# EAGLE design esp-temperature (EAGLE 8.3.1)
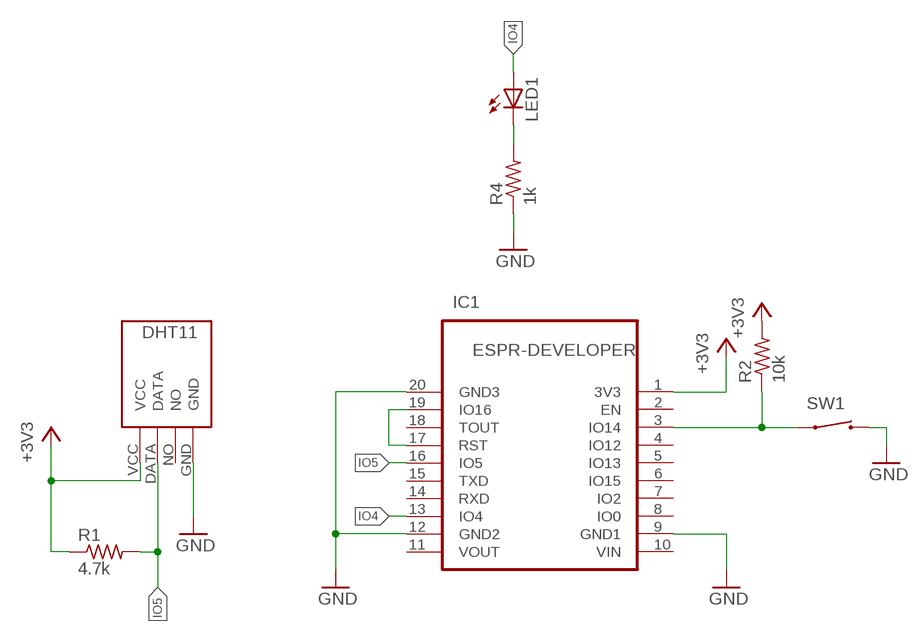
[diagram p0: schematic, sheet 1]

## Parts
IC1  ESPR-DEVELOPER  [ESPR-DEVELOPER]
LED1  LED-SIDEUP2  [LED5MM-SIDE-UP2]
R1  4.7k  R-US_R0805  [R0805]
R2  10k  R-US_R0805  [R0805]
R4  1k  R-US_R0805  [R0805]
SW1  TVBP06  [TVBP06]
U$1  DHT11  [DHT11]

## Nets
+3V3: IC1.1(3V3) R1.1 R2.2 U$1.VCC
GND: IC1.9(GND1) IC1.12(GND2) IC1.20(GND3) R4.1 SW1.2 U$1.GND
IO4: IC1.13(IO4) LED1.A
IO5: IC1.16(IO5) R1.2 U$1.DATA
N$1: IC1.3(IO14) R2.1 SW1.1
N$2: LED1.K(C) R4.2
N$3: IC1.17(RST) IC1.19(IO16)
Unconnected: IC1.2(EN) IC1.4(IO12) IC1.5(IO13) IC1.6(IO15) IC1.7(IO2) IC1.8(IO0) IC1.14(RXD) IC1.15(TXD) IC1.18(TOUT) U$1.NO

## Power pins joined to a net without a drawn wire
VIN: IC1.10(VIN)
VOUT: IC1.11(VOUT)

## Library data of the parts
IC1 = espr-developer:ESPR-DEVELOPER: WiFi module - ESP-WROOM-02
LED1 = led-side:LED-SIDE
R1 R2 R4 = rcl:R-US_: RESISTOR, American symbol
SW1 = switches:TVBP06: 2pin switch. http://akizukidenshi.com/catalog/g/gP-08074/
U$1 = DHT11:DHT11: DHT11 Czujnik temperatury i wilgotności

## Board
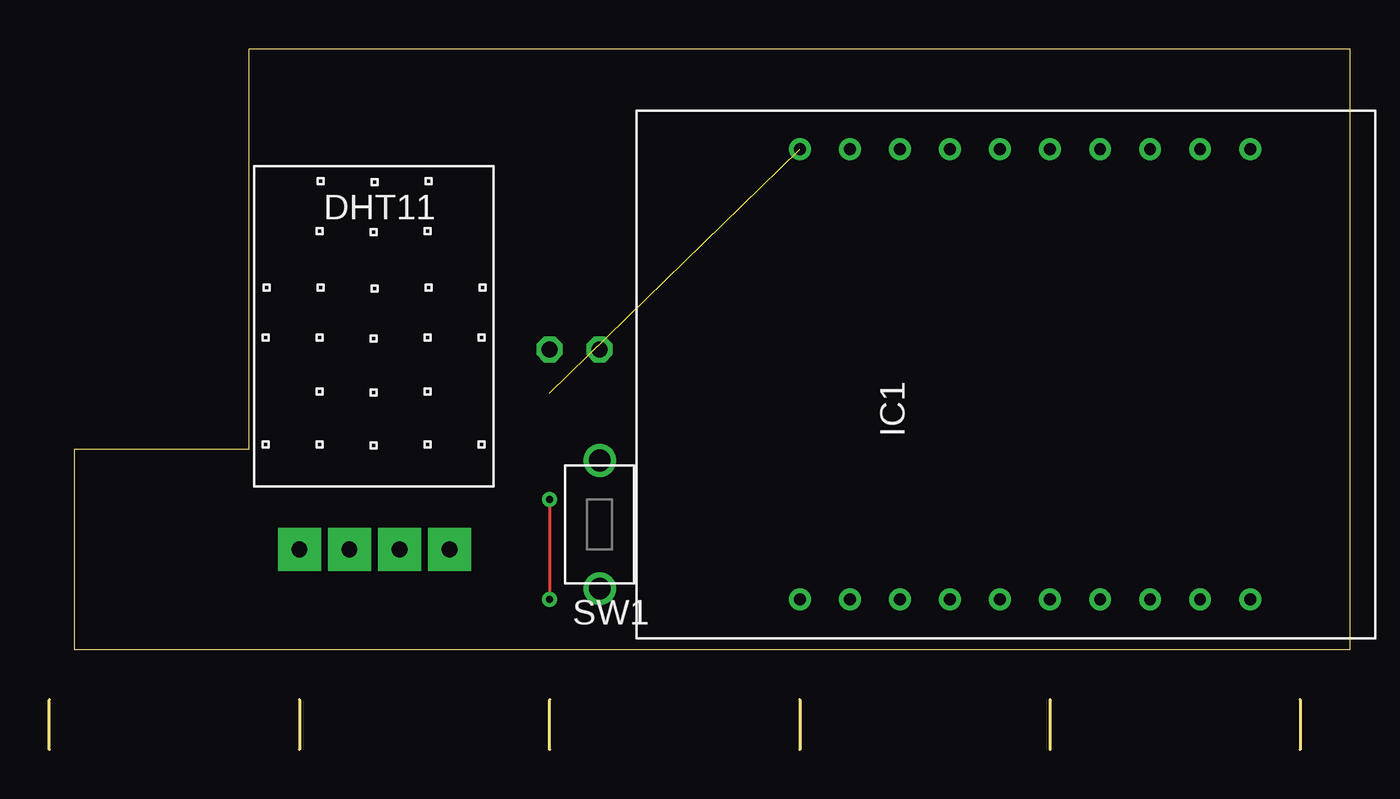
[diagram p1: board, top side]
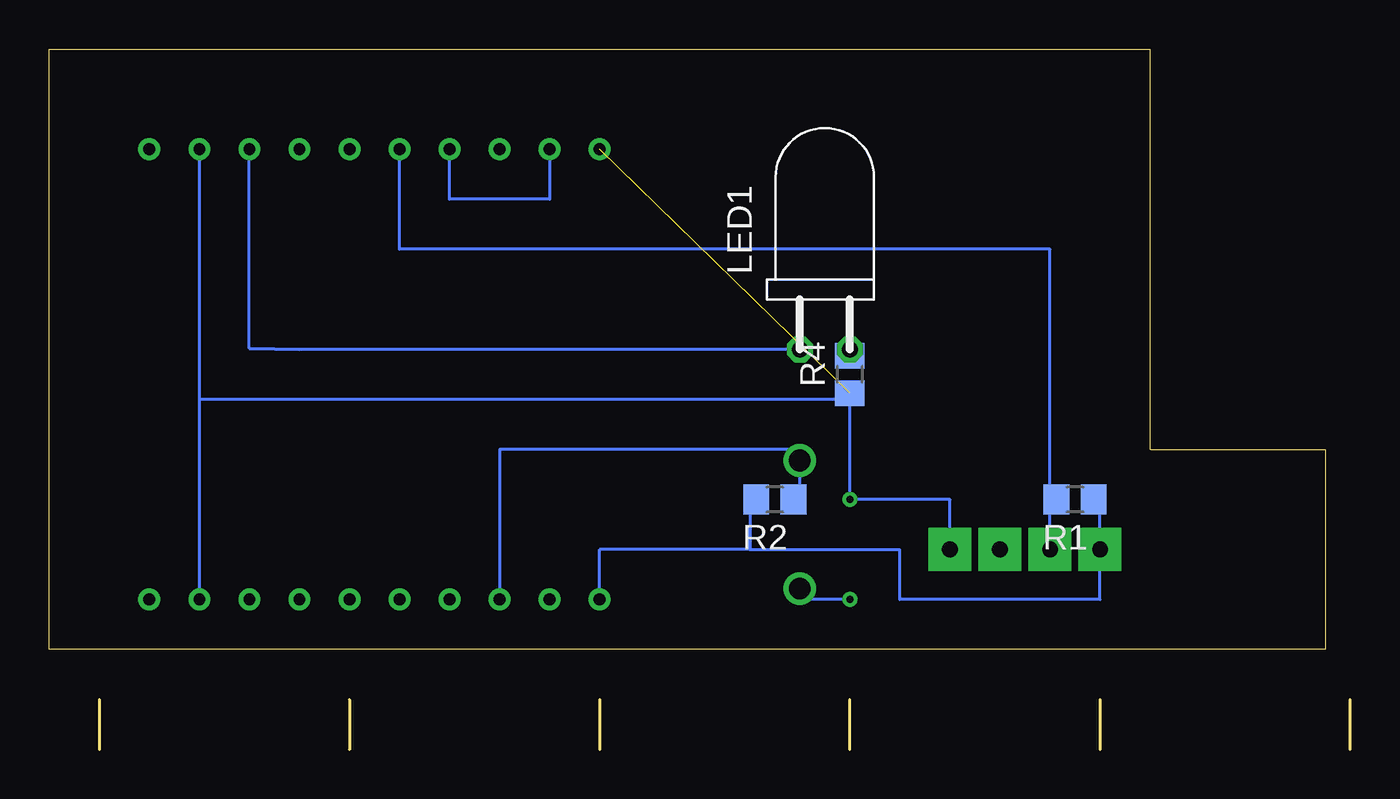
[diagram p2: board, bottom side, seen from below]

Size 66.04 x 35.56 mm. Coordinates in mm from the lower left corner, seen from the top.
Outline: 0,0 0,2.54
Outline: 12.7,2.54 12.7,0
Outline: 25.4,0 25.4,2.54
Outline: 38.1,2.54 38.1,0
Outline: 50.8,2.54 50.8,0
Outline: 63.5,2.54 63.5,0
Outline: 10.16,15.24 1.27,15.24 1.27,5.08 66.04,5.08 66.04,35.56 10.16,35.56 10.16,15.24
Copper layers (1*16): Top 0.035mm / dielectric 1.5mm / Bottom 0.035mm
Design rules "default": minimum track width 6mil, minimum drill 0.35mm, track to track 6mil, track to pad 6mil, pad to pad 6mil, via to via 6mil, smd to smd 6mil, copper to edge 40mil, drill to drill 6mil, minimum pad ring 10mil, minimum via ring 8mil, stop-mask expansion 4mil, vias tented up to drill 0mil, thermal gap 10mil

### Footprints (pad centres in the part's own frame; a part is rotated, then mirrored left to right if it is on the bottom)
ESPR-DEVELOPER = drill 0.6: 1 -11.43,11.43; 2 -11.43,8.89; 3 -11.43,6.35; 4 -11.43,3.81; 5 -11.43,1.27; 6 -11.43,-1.27; 7 -11.43,-3.81; 8 -11.43,-6.35; 9 -11.43,-8.89; 10 -11.43,-11.43; 11 11.43,-11.43; 12 11.43,-8.89; 13 11.43,-6.35; 14 11.43,-3.81; 15 11.43,-1.27; 16 11.43,1.27; 17 11.43,3.81; 18 11.43,6.35; 19 11.43,8.89; 20 11.43,11.43
LED5MM-SIDE-UP2 = drill 0.813 octagon: A -1.27,0; K 1.27,0
R0805 = smd 1.3 x 1.5: 1 -0.95,0; 2 0.95,0
TVBP06 = drill 1.1: 1 -3.25,0; 2 3.25,0
DHT11 = drill 0.8 pad 2.184 square: DATA -1.27,-11.43; GND 3.81,-11.43; NO 1.27,-11.43; VCC -3.81,-11.43

### Placement (x,y rotation side)
IC1  49.53,19.05 90 top
LED1  26.67,20.32 0 bottom
R1  13.97,12.7 180 bottom
R2  29.21,12.7 180 bottom
R4  25.4,19.05 90 bottom
SW1  27.94,11.43 270 top
U$1  16.51,21.59 0 top

### Tracks (layer width: path | path; a pad name or v marks a point on that pad's centre or on a via)
+3V3
  Bottom 0.152: IC1.1 38.1,10.16 30.48,10.16 | 30.48,10.16 22.86,10.16 22.86,7.62 12.7,7.62 U$1.VCC 12.7,12.38 R1.1 | R2.2 30.48,12.7 30.48,10.16
GND  (via drill 0.35)  (1 unrouted)
  Top 0.152: 25.4,12.67 v25.4,12.7 | 25.4,12.67 v25.4,7.62 | 25.37,12.7 25.4,12.67
  Bottom 0.152: U$1.GND 20.32,12.7 v25.4,12.7 25.4,17.78 25.44,17.78 | v25.4,7.62 27.38,7.62 SW1.2 | 58.42,17.78 IC1.9 | IC1.12 58.42,17.78 | 25.44,17.78 58.42,17.78 | R4.1 25.4,17.82 25.44,17.78
IO4
  Bottom 0.152: 55.88,20.37 53.34,20.32 | 55.88,20.37 IC1.13 | LED1.A 53.3,20.32 55.88,20.37
IO5
  Bottom 0.152: 15.24,12.7 15.24,25.4 48.26,25.4 IC1.16 | R1.2 15.24,12.7 | U$1.DATA 15.24,12.7
N$1
  Bottom 0.152: 27.83,14.68 SW1.1 | 27.83,14.68 27.38,14.68 27.94,15.24 43.18,15.24 IC1.3 | R2.1 27.94,12.7 27.94,14.57 27.83,14.68
N$2
  Bottom 0.152: R4.2 LED1.K
N$3
  Bottom 0.152: IC1.19 40.64,27.94 45.72,27.94 IC1.17